# EasyEDA schematic SCH_ROBOTIC ARM_2022-05-08.json
TITLE: ROBOTIC ARM; REV: 1.0; Date: 2022-05-08; Sheet: 1/1; Drawn By: Atul Dighe; Company: SAI SOLUTIONS PVT. LTD.
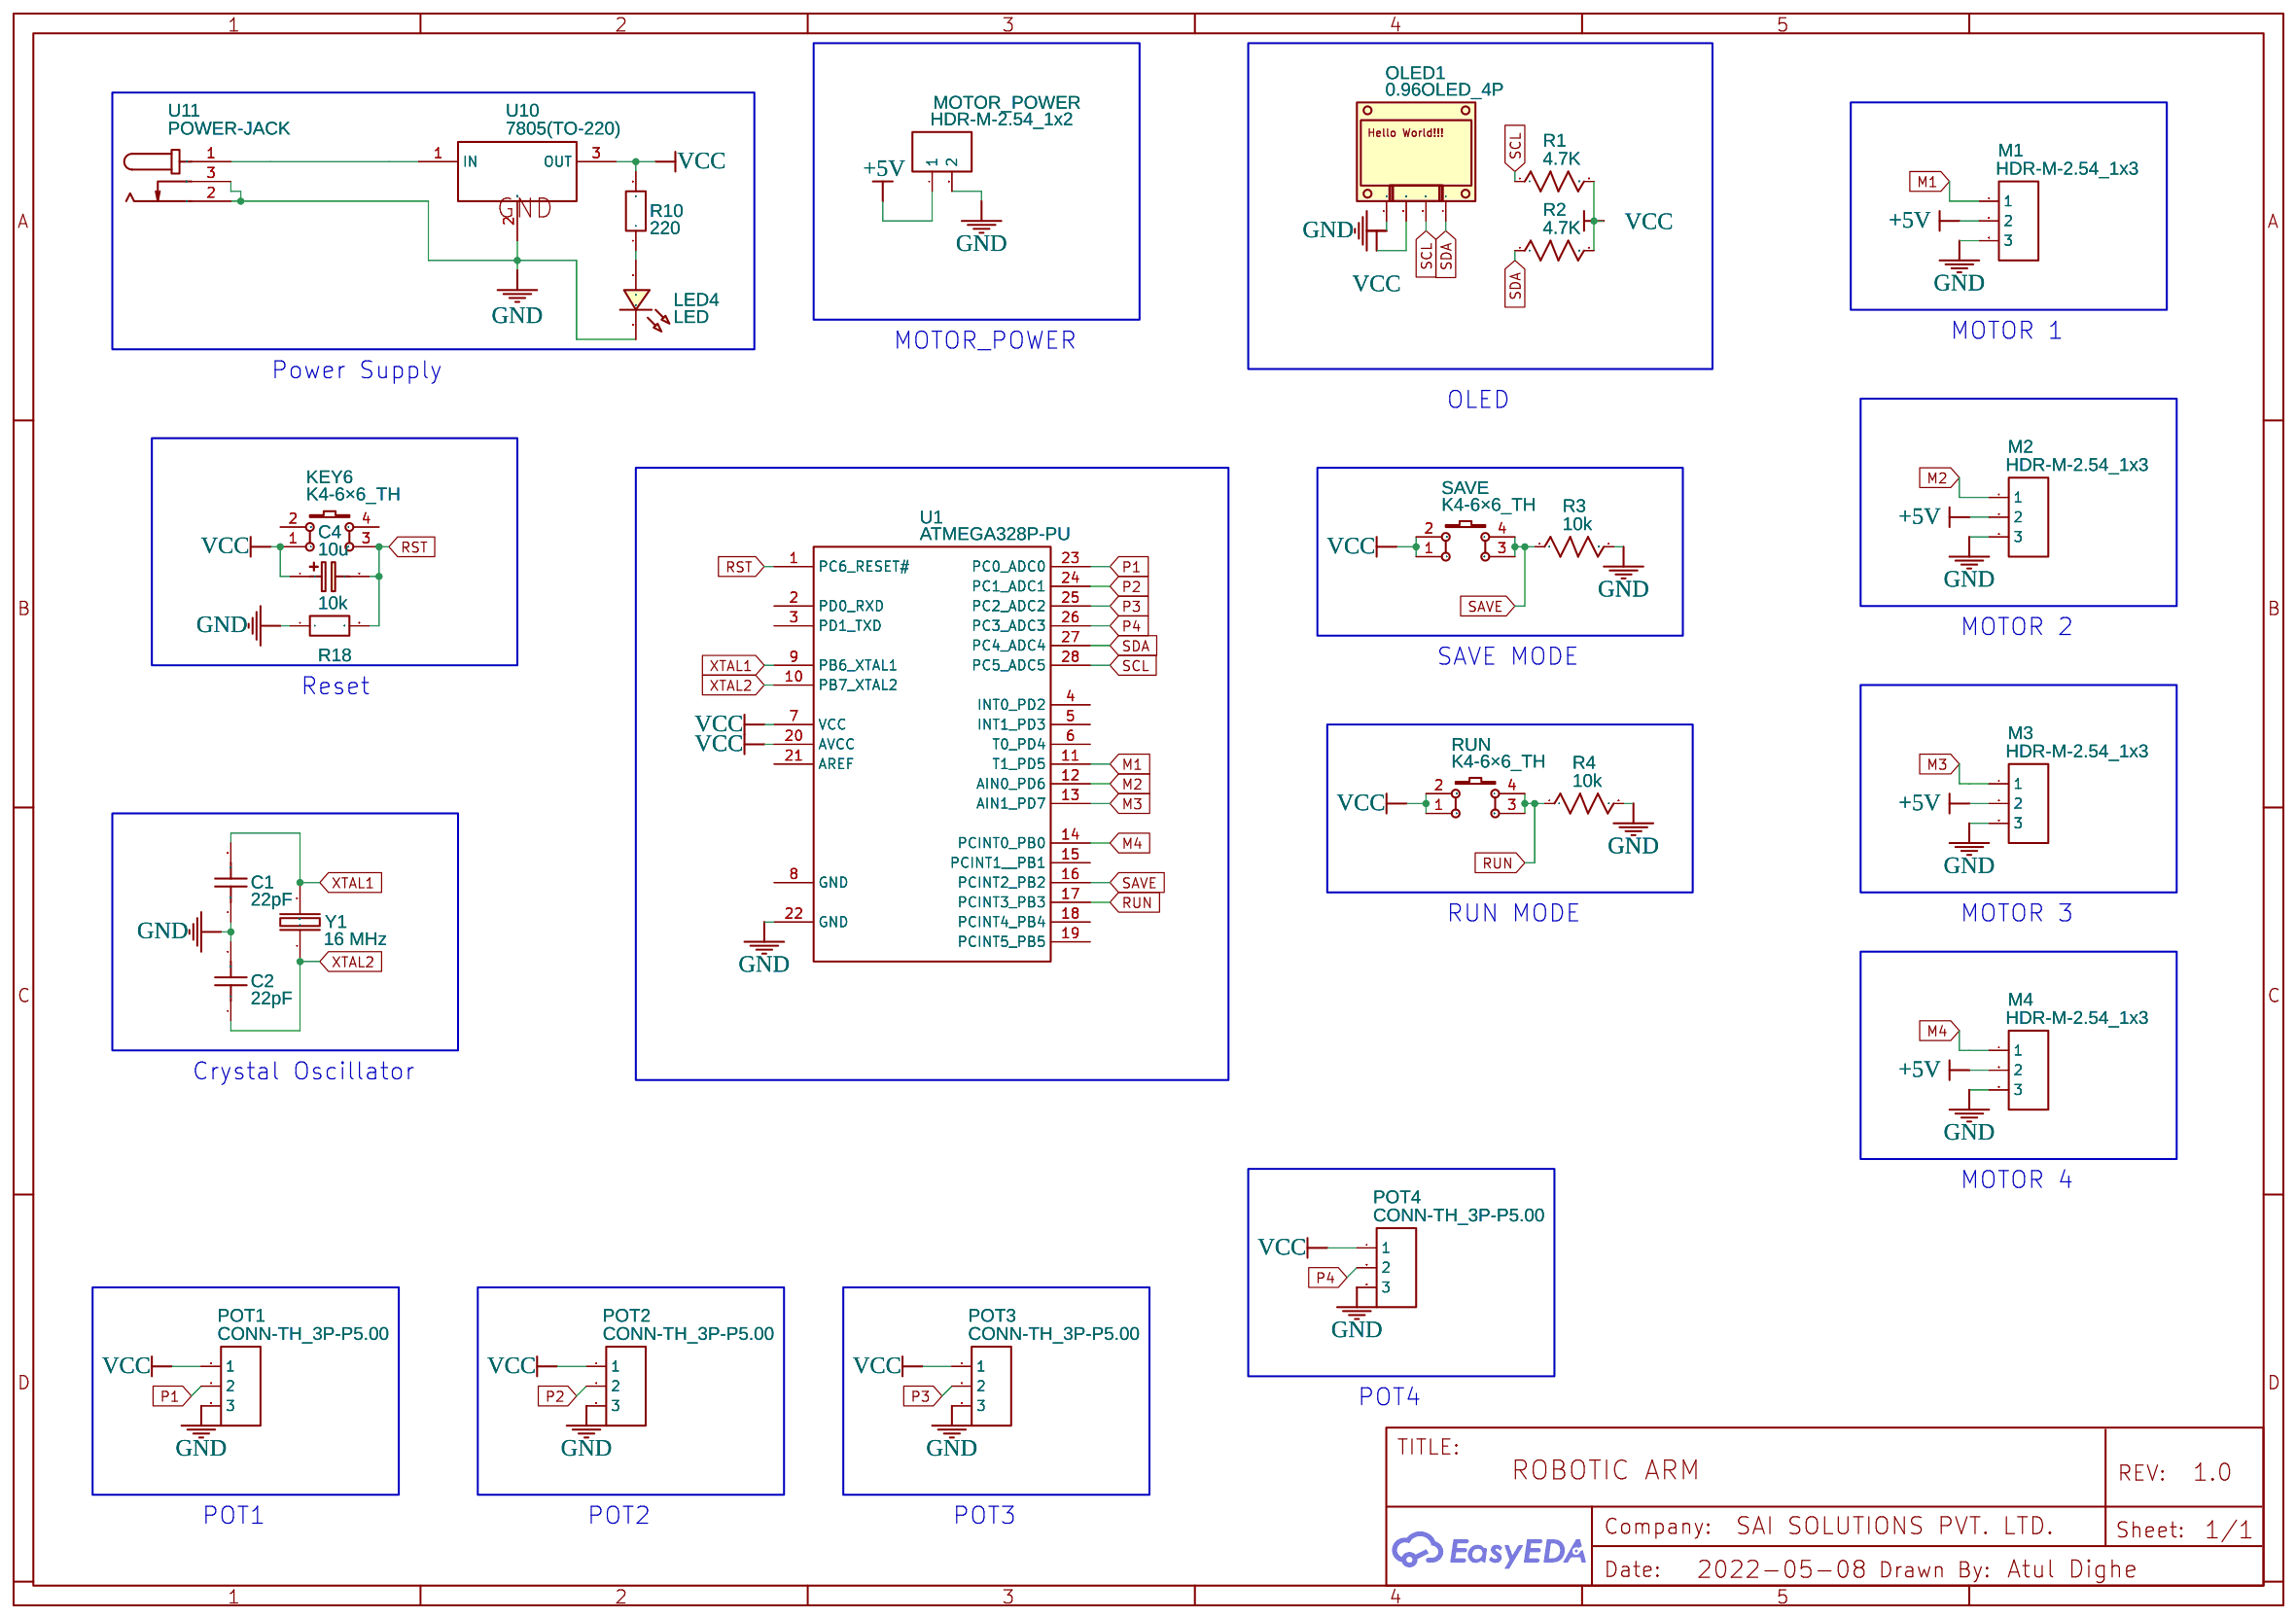
[diagram p0: schematic sheet]

## Parts
C1  22pF  [RAD-0.1]
C2  22pF  [RAD-0.1]
C4  10u  [CAP-D8.0×F3.5]
KEY6  K4-6×6_TH  [KEY-TH_4P-L6.0-W6.0-P4.50-LS6.5]
LED4  LED  [LED-TH_BD3.0_RED]
M1  HDR-M-2.54_1x3  [HDR-M-2.54_1X3]
M2  HDR-M-2.54_1x3  [HDR-M-2.54_1X3]
M3  HDR-M-2.54_1x3  [HDR-M-2.54_1X3]
M4  HDR-M-2.54_1x3  [HDR-M-2.54_1X3]
MOTOR_POWER  HDR-M-2.54_1x2  [HDR-M-2.54_1X2]
OLED1  0.96OLED_4P  [0.96OLED_4P]
POT1  CONN-TH_3P-P5.00  [CONN-TH_3P-P5.00]
POT2  CONN-TH_3P-P5.00  [CONN-TH_3P-P5.00]
POT3  CONN-TH_3P-P5.00  [CONN-TH_3P-P5.00]
POT4  CONN-TH_3P-P5.00  [CONN-TH_3P-P5.00]
R1  4.7K  [R_AXIAL-0.4]
R2  4.7K  [R_AXIAL-0.4]
R3  10k  [R_AXIAL-0.4]
R4  10k  [R_AXIAL-0.4]
R10  220  [R_AXIAL-0.3]
R18  10k  [R_AXIAL-0.3]
RUN  K4-6×6_TH  [KEY-TH_4P-L6.0-W6.0-P4.50-LS6.5]
SAVE  K4-6×6_TH  [KEY-TH_4P-L6.0-W6.0-P4.50-LS6.5]
U1  ATMEGA328P-PU  [DIP-28_L34.6-W7.3-P2.54-LS10.2-BL]
U10  7805(TO-220)  [TO-220-3_L10.0-W4.5-P2.54-L]
U11  POWER-JACK  [DC-IN-TH_POWER-JACK]
Y1  16 MHz  [CRYSTAL_OSCILLATOR_200MIL_PACKAGE]

## Library data of the parts
C1 C2 = C_RAD-0.1_US: Contributor: LCEDA_Lib
C4 = CE_TH_D8.0×F3.5_EU: Contributor: LCEDA_Lib
KEY6 RUN SAVE = K4-6×6_TH: Supplier: LCSC; Supplier Part: C136684; Manufacturer: 韩国韩荣; Manufacturer Part: K2-1102DP-E4SW-04; Contributor: LCEDA_Lib
LED4 = LED-TH-3mm_R: Manufacturer: EVERLIGHT(台湾亿光); Manufacturer Part: 204-10SDRD/S530-A3-L; Supplier Part: C84774; Supplier: LCSC; Contributor: LCEDA_Lib
M1-M4 = HDR-M-2.54_1x3: Supplier Part: C180248; Supplier: LCSC; Contributor: LCEDA_Lib
MOTOR_POWER = HDR-M-2.54_1x2: Supplier Part: C124375; Supplier: LCSC; Contributor: LCEDA_Lib
OLED1 = 0.96OLED_4P: Supplier: LCSC; Contributor: LCEDA_Lib
POT1-POT4 = CONN-TH_3P-P5.00: Supplier: LCSC; Contributor: LCEDA_Lib
R1-R4 = R_AXIAL-0.4_US: Contributor: LCEDA_Lib
R10 R18 = R_AXIAL-0.3_EU: Contributor: LCEDA_Lib
U1 = ATMEGA328P-PU: sourceId: Oic6oiASL; Supplier: LCSC; Manufacturer: MICROCHIP; Contributor: LCSC; Supplier Part: C33901; JLCPCB Part Class: Extended Part
U10 = 7805(TO-220): Supplier: LCSC; Manufacturer: STMicroelectronics; Manufacturer Part: L7805CV-DG; Supplier Part: C3795; Contributor: LCEDA_Lib
U11 = POWER-JACK: Supplier: LCSC; Supplier Part: C9900001795; Manufacturer: null; JLCPCB Part Class: Extended Part; Contributor: LCSC
Y1 = ?MHz: Manufacturer Part: N/A; Contributor: jwtfpv

## Nets
+5V: M1.2 M2.2 M3.2 M4.2 MOTOR_POWER.1
GND: C1.1 C2.2 LED4.2 M1.3 M2.3 M3.3 M4.3 MOTOR_POWER.2 OLED1.1 POT1.3 POT2.3 POT3.3 POT4.3 R3.2 R4.2 R18.1 U1.22(GND) U10.2(GND) U11.2 U11.3
VCC: C4.1 KEY6.1 OLED1.2 POT1.1 POT2.1 POT3.1 POT4.1 R1.2 R2.2 R10.2 RUN.1 RUN.2 SAVE.1 SAVE.2 U1.7(VCC) U1.20(AVCC) U10.3(OUT)
M1: M1.1 U1.11(T1 PD5)
M2: M2.1 U1.12(AIN0 PD6)
M3: M3.1 U1.13(AIN1 PD7)
M4: M4.1 U1.14(PCINT0 PB0)
P1: POT1.2 U1.23(PC0 ADC0)
P2: POT2.2 U1.24(PC1 ADC1)
P3: POT3.2 U1.25(PC2 ADC2)
P4: POT4.2 U1.26(PC3 ADC3)
RST: C4.2 KEY6.3 R18.2 U1.1(PC6 RESET#)
RUN: R4.1 RUN.3 RUN.4 U1.17(PCINT3 PB3)
SAVE: R3.1 SAVE.3 SAVE.4 U1.16(PCINT2 PB2)
SCL: OLED1.3 R1.1 U1.28(PC5 ADC5)
SDA: OLED1.4 R2.1 U1.27(PC4 ADC4)
XTAL1: C1.2 U1.9(PB6 XTAL1) Y1.2
XTAL2: C2.1 U1.10(PB7 XTAL2) Y1.1
Net-(LED4-1): LED4.1 R10.1
Net-(U10-1): U10.1(IN) U11.1

Not connected (* = marked no-connect by the designer): KEY6 2 4; U1 2(PD0 RXD) 3(PD1 TXD) 4(INT0 PD2) 5(INT1 PD3) 6(T0 PD4) 8(GND) 15(PCINT1  PB1) 18(PCINT4 PB4) 19(PCINT5 PB5) 21(AREF)

## Notes on the sheet
- MOTOR 1
- MOTOR_POWER
- Power Supply
- OLED
- MOTOR 2
- SAVE MODE
- Reset
- RUN MODE
- MOTOR 3
- Crystal Oscillator
- MOTOR 4
- POT4
- POT1
- POT2
- POT3
